# EAGLE design BPW5046-RGB-LED-Panel (EAGLE 6.6.0)
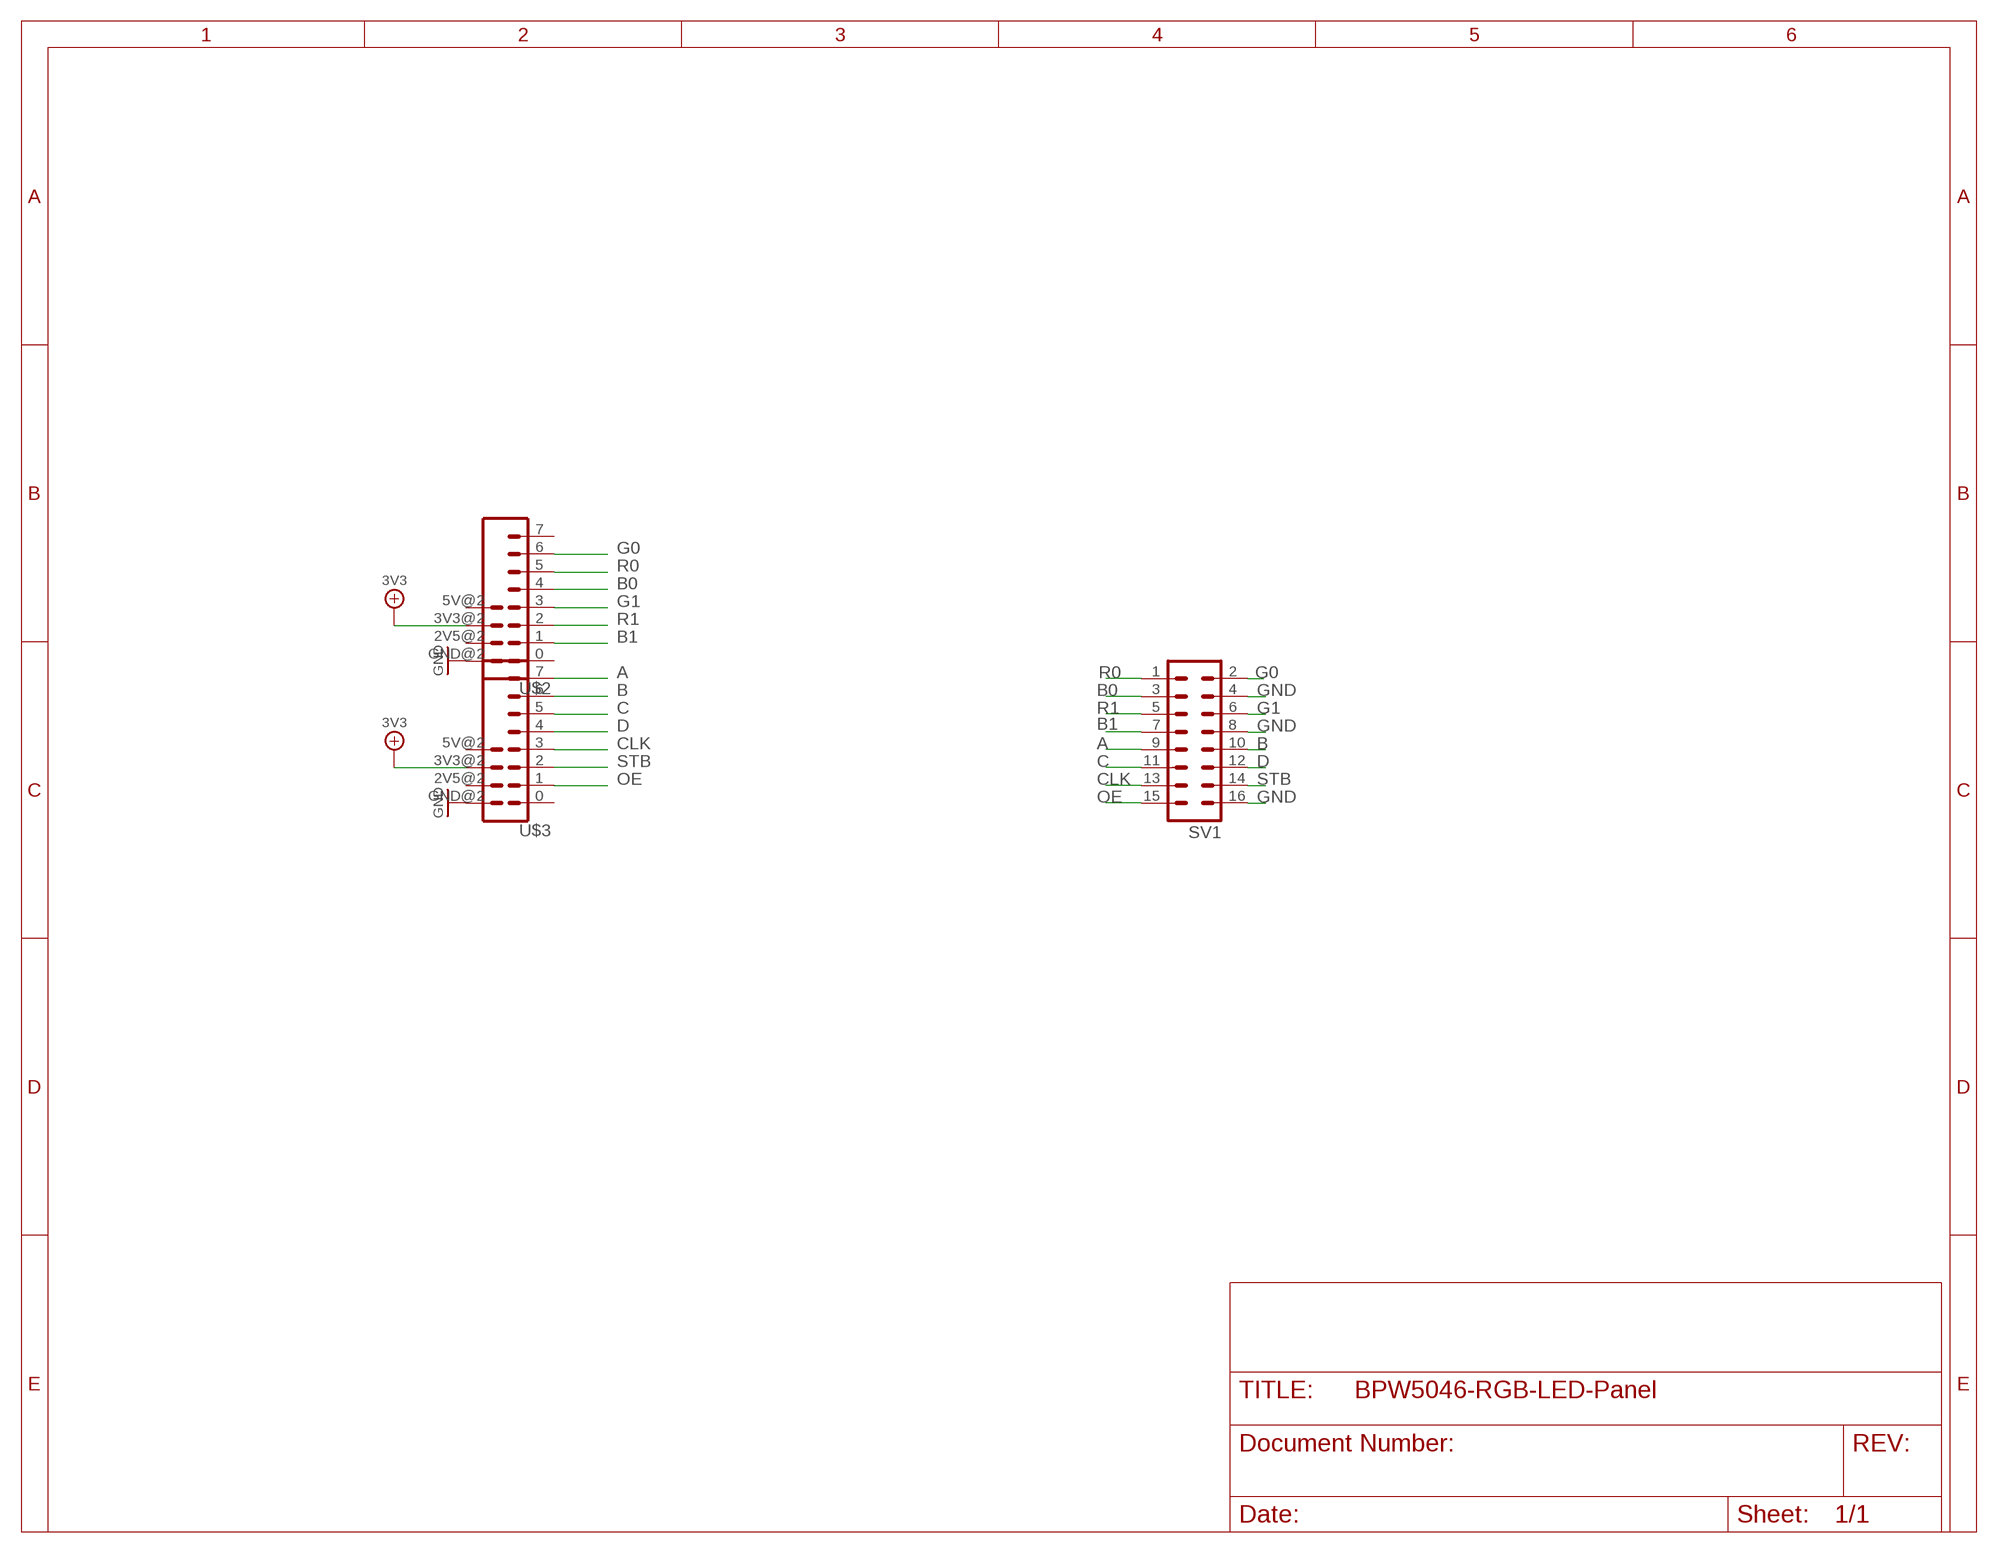
[diagram p0: schematic, sheet 1]

## Parts
SV1  ML16  [ML16]
U$2  WING8WING8_NOHOLES  [WINGSIDE_8BIT_NOHOLES]
U$3  WING8WING8_NOHOLES  [WINGSIDE_8BIT_NOHOLES]

## Nets
3V3: U$2.3V3@2(3V3) U$3.3V3@2(3V3)
A: SV1.9 U$3.7
B: SV1.10 U$3.6
B0: SV1.3 U$2.4
B1: SV1.7 U$2.1
C: SV1.11 U$3.5
CLK: SV1.13 U$3.3
D: SV1.12 U$3.4
G0: SV1.2 U$2.6
G1: SV1.6 U$2.3
GND: SV1.4 SV1.8 SV1.16 U$2.GND@2(GND) U$3.GND@2(GND)
OE: SV1.15 U$3.1
R0: SV1.1 U$2.5
R1: SV1.5 U$2.2
STB: SV1.14 U$3.2
Unconnected: U$2.0 U$2.2V5@2(2V5) U$2.5V@2(5V) U$2.7 U$3.0 U$3.2V5@2(2V5) U$3.5V@2(5V)

## Library data of the parts
SV1 = con-ml:ML16: HARTING; PARTNO: PRPC004DAAN-RC
U$2 U$3 = Papilio:WING8; PARTNO: 68001-112HLF

## Board
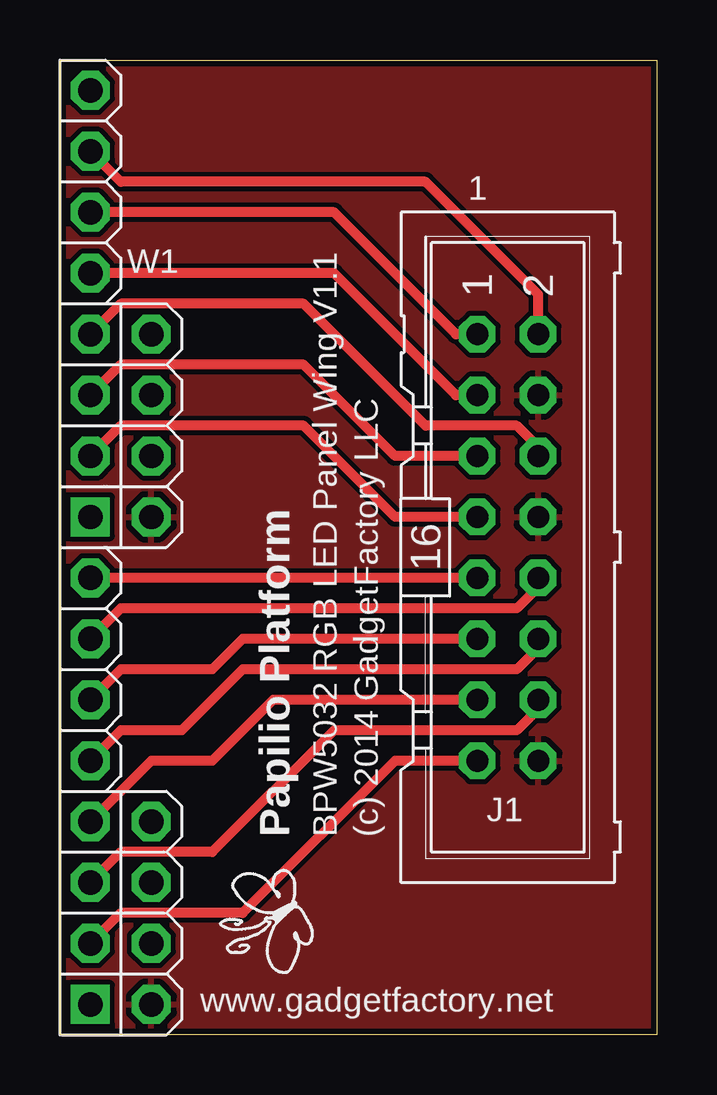
[diagram p1: board, top side]
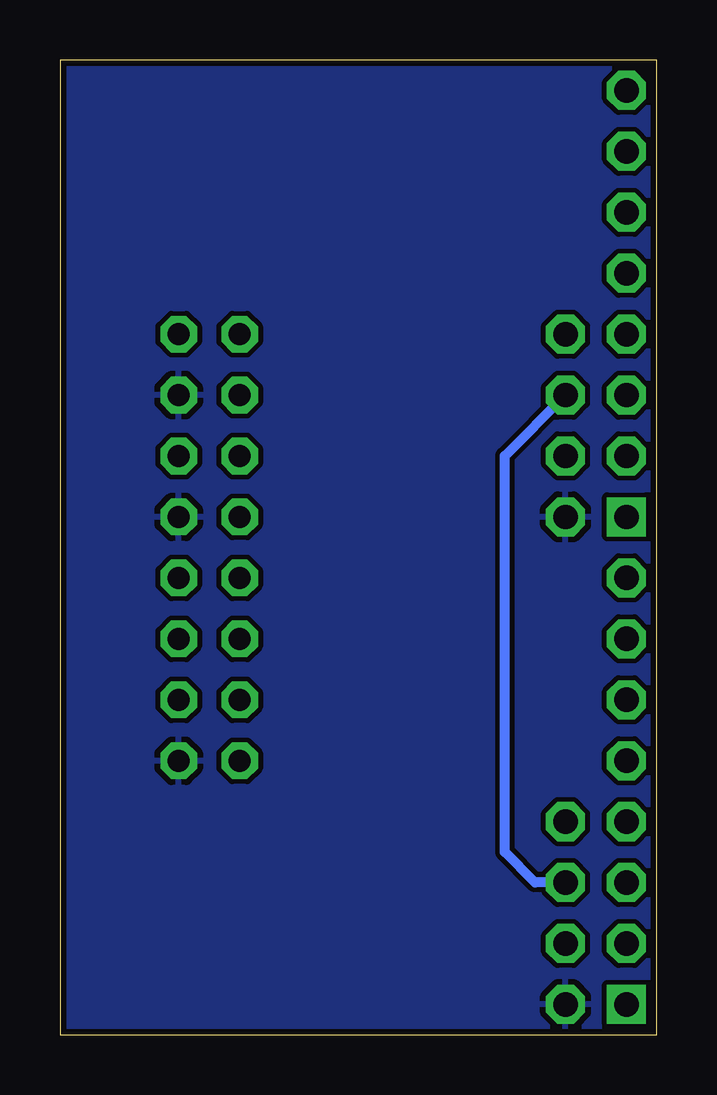
[diagram p2: board, bottom side, seen from below]

Size 24.89 x 40.64 mm. Coordinates in mm from the lower left corner, seen from the top.
Outline: 0,0 0,40.64 24.89,40.64 24.89,0 0,0
Copper layers (1*16): Top 0.035mm / dielectric 1.5mm / Bottom 0.035mm
Design rules "SparkFun_Derived_GoldePheonix_10mil": minimum track width 10mil, minimum drill 15mil, track to track 8mil, track to pad 8mil, pad to pad 8mil, via to via 8mil, smd to smd 8mil, copper to edge 10mil, drill to drill 8mil, minimum pad ring 12mil, minimum via ring 10mil, stop-mask expansion 4mil, vias tented up to drill 18mil, thermal gap 10mil

### Footprints (pad centres in the part's own frame; a part is rotated, then mirrored left to right if it is on the bottom)
ML16 = drill 0.914 octagon: 1 -8.89,-1.27; 2 -8.89,1.27; 3 -6.35,-1.27; 4 -6.35,1.27; 5 -3.81,-1.27; 6 -3.81,1.27; 7 -1.27,-1.27; 8 -1.27,1.27; 9 1.27,-1.27; 10 1.27,1.27; 11 3.81,-1.27; 12 3.81,1.27; 13 6.35,-1.27; 14 6.35,1.27; 15 8.89,-1.27; 16 8.89,1.27
WINGSIDE_8BIT_NOHOLES = drill 1.016 square: 0 19.05,1.27 | drill 1.016 octagon: 1 16.51,1.27; 2 13.97,1.27; 2V5@2 16.51,3.81; 3 11.43,1.27; 3V3@2 13.97,3.81; 4 8.89,1.27; 5 6.35,1.27; 5V@2 11.43,3.81; 6 3.81,1.27; 7 1.27,1.27; GND@2 19.05,3.81

### Placement (x,y rotation side)
SV1  18.67,20.32 270 top
U$1  [BUTTERFLY_LOGO]  9.14,4.83 90 top
U$2  0,40.64 270 top
U$3  0,20.32 270 top

### Tracks (layer width: path | path; a pad name or v marks a point on that pad's centre or on a via)
3V3
  Bottom 0.406: U$3.3V3@2 5.08,6.35 6.35,7.62 6.35,24.13 U$2.3V3@2
A
  Top 0.406: SV1.9 U$3.7
B
  Top 0.406: SV1.10 19.94,18.67 19.05,17.78 2.54,17.78 U$3.6
B0
  Top 0.406: SV1.3 16.51,26.67 11.43,31.75 U$2.4
B1
  Top 0.406: SV1.7 13.97,21.59 10.16,25.4 2.54,25.4 U$2.1
C
  Top 0.406: SV1.11 7.62,16.51 6.35,15.24 2.54,15.24 U$3.5
CLK
  Top 0.406: SV1.13 8.89,13.97 6.35,11.43 3.81,11.43 U$3.3
D
  Top 0.406: SV1.12 19.94,16.13 19.05,15.24 7.62,15.24 5.08,12.7 2.54,12.7 U$3.4
G0
  Top 0.406: SV1.2 19.94,30.86 15.24,35.56 2.54,35.56 U$2.6
G1
  Top 0.406: SV1.6 19.94,24.51 19.05,25.4 15.24,25.4 10.16,30.48 2.54,30.48 U$2.3
GND
  pour Top: 0,0 0,40.64 24.89,40.64 24.89,0
  pour Bottom: 0,0 0,40.64 24.89,40.64 24.89,0
OE
  Top 0.406: SV1.15 13.97,11.43 7.62,5.08 2.54,5.08 U$3.1
R0
  Top 0.406: SV1.1 16.51,29.21 11.43,34.29 U$2.5
R1
  Top 0.406: SV1.5 13.97,24.13 10.16,27.94 2.54,27.94 U$2.2
STB
  Top 0.406: SV1.14 19.94,13.59 19.05,12.7 11.43,12.7 6.35,7.62 2.54,7.62 U$3.2

### Text on the board
tPlace: Papilio Platform | BPW5032 RGB LED Panel Wing V1.1 | (c) 2014 GadgetFactory LLC | www.gadgetfactory.net
tNames: 1 | W1 | J1